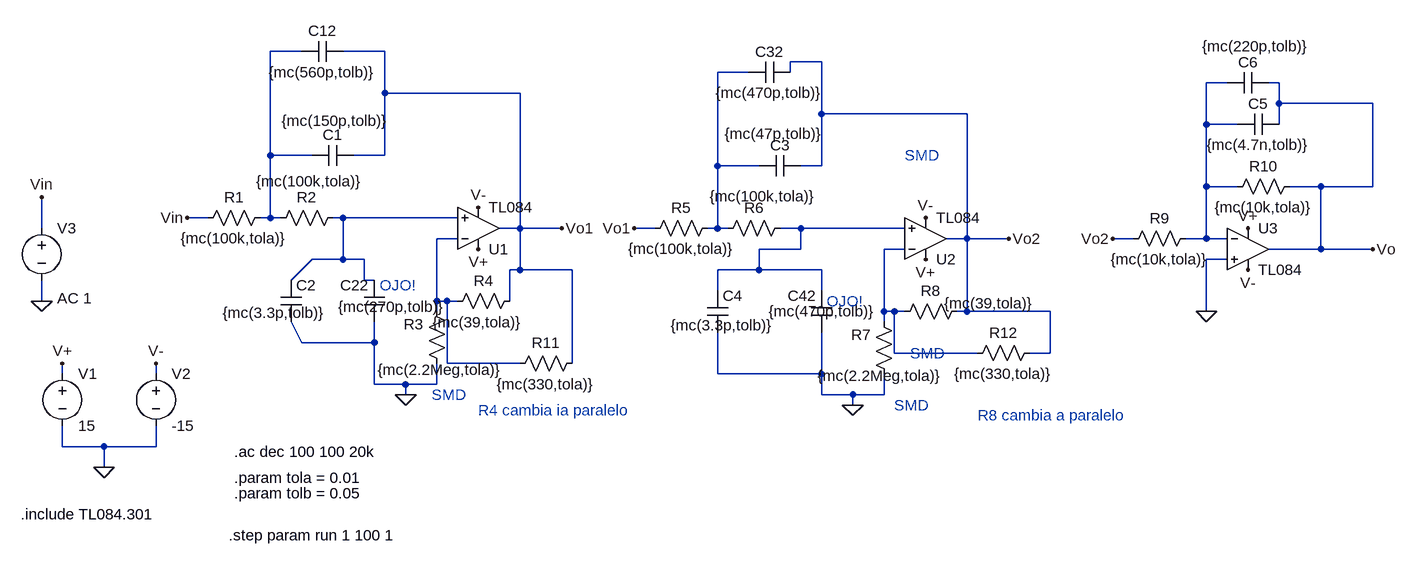
[diagram p0: schematic NUEVO Bessel CON TOLERANCIAS.asc]
NUEVO Bessel CON TOLERANCIAS.asc, the LTspice schematic file:
Version 4
SHEET 1 1604 680
WIRE -160 -96 -208 -96
WIRE -32 -96 -96 -96
WIRE 640 -80 592 -80
WIRE 528 -64 480 -64
WIRE 592 -64 592 -80
WIRE 1264 -48 1232 -48
WIRE 1344 -48 1328 -48
WIRE -32 -32 -32 -96
WIRE 176 -32 -32 -32
WIRE 1344 -16 1344 -48
WIRE 1488 -16 1344 -16
WIRE 640 0 640 -80
WIRE 864 0 640 0
WIRE 1232 16 1232 -48
WIRE 1280 16 1232 16
WIRE 1344 16 1344 -16
WIRE -208 64 -208 -96
WIRE -144 64 -208 64
WIRE -32 64 -32 -32
WIRE -32 64 -80 64
WIRE 480 80 480 -64
WIRE 544 80 480 80
WIRE 640 80 640 0
WIRE 640 80 608 80
WIRE 1232 112 1232 16
WIRE 1280 112 1232 112
WIRE 1408 112 1360 112
WIRE 1488 112 1488 -16
WIRE 1488 112 1408 112
WIRE -304 160 -336 160
WIRE -208 160 -208 64
WIRE -208 160 -224 160
WIRE -192 160 -208 160
WIRE -96 160 -112 160
WIRE 80 160 -96 160
WIRE -560 176 -560 128
WIRE 176 176 176 -32
WIRE 176 176 144 176
WIRE 240 176 176 176
WIRE 384 176 352 176
WIRE 480 176 480 80
WIRE 480 176 464 176
WIRE 496 176 480 176
WIRE 608 176 576 176
WIRE 768 176 608 176
WIRE 80 192 48 192
WIRE 864 192 864 0
WIRE 864 192 832 192
WIRE 928 192 864 192
WIRE 1120 192 1088 192
WIRE 1232 192 1232 112
WIRE 1232 192 1200 192
WIRE 1264 192 1232 192
WIRE 608 208 608 176
WIRE 608 208 544 208
WIRE 768 208 736 208
WIRE 1408 208 1408 112
WIRE 1408 208 1328 208
WIRE 1488 208 1408 208
WIRE -96 224 -96 160
WIRE -96 224 -144 224
WIRE -64 224 -96 224
WIRE 1264 224 1232 224
WIRE 176 240 176 176
WIRE 176 240 160 240
WIRE 256 240 176 240
WIRE 544 240 544 208
WIRE 544 240 480 240
WIRE 640 240 544 240
WIRE -176 256 -144 224
WIRE -64 256 -64 224
WIRE -48 256 -64 256
WIRE 480 272 480 240
WIRE 640 272 640 240
WIRE -560 288 -560 256
WIRE 48 288 48 192
WIRE 64 288 48 288
WIRE 80 288 64 288
WIRE 160 288 160 240
WIRE 48 304 48 288
WIRE 736 304 736 208
WIRE 752 304 736 304
WIRE 768 304 752 304
WIRE 864 304 864 192
WIRE 864 304 848 304
WIRE 992 304 864 304
WIRE 1232 304 1232 224
WIRE 736 320 736 304
WIRE -160 352 -176 320
WIRE -48 352 -48 320
WIRE -48 352 -160 352
WIRE 752 368 752 304
WIRE 880 368 752 368
WIRE 992 368 992 304
WIRE 992 368 960 368
WIRE 64 384 64 288
WIRE 176 384 64 384
WIRE 256 384 256 240
WIRE -528 400 -528 384
WIRE -384 400 -384 384
WIRE 480 400 480 336
WIRE 640 400 640 336
WIRE 640 400 480 400
WIRE -48 416 -48 352
WIRE 0 416 -48 416
WIRE 48 416 48 384
WIRE 48 416 0 416
WIRE 0 432 0 416
WIRE 640 432 640 400
WIRE 688 432 640 432
WIRE 736 432 736 400
WIRE 736 432 688 432
WIRE 688 448 688 432
WIRE -528 512 -528 480
WIRE -464 512 -528 512
WIRE -384 512 -384 480
WIRE -384 512 -464 512
WIRE -464 544 -464 512
FLAG 0 432 0
FLAG 112 208 V+
FLAG 1296 176 V+
FLAG 112 144 V-
FLAG 1296 240 V-
FLAG -336 160 Vin
FLAG 240 176 Vo1
FLAG 688 448 0
FLAG 800 224 V+
FLAG 800 160 V-
FLAG 352 176 Vo1
FLAG 928 192 Vo2
FLAG 1088 192 Vo2
FLAG 1232 304 0
FLAG 1488 208 Vo
FLAG -464 544 0
FLAG -528 384 V+
FLAG -384 384 V-
FLAG -560 288 0
FLAG -560 128 Vin
SYMBOL Opamps\\opamp2 112 240 M180
SYMATTR InstName U1
SYMATTR Value TL084
SYMBOL res -208 144 R90
WINDOW 0 0 56 VBottom 2
WINDOW 3 32 56 VTop 2
SYMATTR InstName R1
SYMATTR Value {mc(100k,tola)}
SYMBOL res -96 144 R90
WINDOW 0 0 56 VBottom 2
WINDOW 3 -56 52 VTop 2
SYMATTR InstName R2
SYMATTR Value {mc(100k,tola)}
SYMBOL res 64 400 R180
WINDOW 0 36 76 Left 2
WINDOW 3 -85 6 Left 2
SYMATTR InstName R3
SYMATTR Value {mc(2.2Meg,tola)}
SYMBOL cap -80 48 R90
WINDOW 0 0 32 VBottom 2
WINDOW 3 -53 28 VTop 2
SYMATTR InstName C1
SYMATTR Value {mc(150p,tolb)}
SYMBOL cap -32 320 R180
WINDOW 0 24 56 Left 2
WINDOW 3 -93 23 Left 2
SYMATTR InstName C22
SYMATTR Value {mc(270p,tolb)}
SYMBOL Opamps\\opamp2 800 256 M180
SYMATTR InstName U2
SYMATTR Value TL084
SYMBOL res 480 160 R90
WINDOW 0 0 56 VBottom 2
WINDOW 3 32 56 VTop 2
SYMATTR InstName R5
SYMATTR Value {mc(100k,tola)}
SYMBOL res 592 160 R90
WINDOW 0 0 56 VBottom 2
WINDOW 3 -49 42 VTop 2
SYMATTR InstName R6
SYMATTR Value {mc(100k,tola)}
SYMBOL res 752 416 R180
WINDOW 0 36 76 Left 2
WINDOW 3 -74 13 Left 2
SYMATTR InstName R7
SYMATTR Value {mc(2.2Meg,tola)}
SYMBOL res 752 320 R270
WINDOW 0 32 56 VTop 2
WINDOW 3 44 146 VBottom 2
SYMATTR InstName R8
SYMATTR Value {mc(39,tola)}
SYMBOL cap 656 336 R180
WINDOW 0 24 56 Left 2
WINDOW 3 -68 32 Left 2
SYMATTR InstName C42
SYMATTR Value {mc(470p,tolb)}
SYMBOL res 1216 176 R90
WINDOW 0 0 56 VBottom 2
WINDOW 3 32 56 VTop 2
SYMATTR InstName R9
SYMATTR Value {mc(10k,tola)}
SYMBOL Opamps\\opamp2 1296 144 R0
SYMATTR InstName U3
SYMATTR Value TL084
SYMBOL cap 1344 0 R90
WINDOW 0 0 32 VBottom 2
WINDOW 3 32 32 VTop 2
SYMATTR InstName C5
SYMATTR Value {mc(4.7n,tolb)}
SYMBOL res 1376 96 R90
WINDOW 0 0 56 VBottom 2
WINDOW 3 32 56 VTop 2
SYMATTR InstName R10
SYMATTR Value {mc(10k,tola)}
SYMBOL voltage -528 384 R0
WINDOW 123 0 0 Left 0
WINDOW 39 0 0 Left 0
SYMATTR InstName V1
SYMATTR Value 15
SYMBOL voltage -384 384 R0
WINDOW 123 0 0 Left 0
WINDOW 39 0 0 Left 0
SYMATTR InstName V2
SYMATTR Value -15
SYMBOL voltage -560 160 R0
WINDOW 123 24 124 Left 2
WINDOW 39 0 0 Left 0
SYMATTR Value2 AC 1
SYMATTR InstName V3
SYMATTR Value ""
SYMBOL cap -192 256 R0
WINDOW 3 -89 50 Left 2
SYMATTR InstName C2
SYMATTR Value {mc(3.3p,tolb)}
SYMBOL cap -96 -112 R90
WINDOW 0 0 32 VBottom 2
WINDOW 3 32 32 VTop 2
SYMATTR InstName C12
SYMATTR Value {mc(560p,tolb)}
SYMBOL cap 608 64 R90
WINDOW 0 0 32 VBottom 2
WINDOW 3 -49 41 VTop 2
SYMATTR InstName C3
SYMATTR Value {mc(47p,tolb)}
SYMBOL cap 592 -80 R90
WINDOW 0 0 32 VBottom 2
WINDOW 3 32 32 VTop 2
SYMATTR InstName C32
SYMATTR Value {mc(470p,tolb)}
SYMBOL cap 464 272 R0
WINDOW 3 -56 53 Left 2
SYMATTR Value {mc(3.3p,tolb)}
SYMATTR InstName C4
SYMBOL cap 1328 -64 R90
WINDOW 0 0 32 VBottom 2
WINDOW 3 -56 20 VTop 2
SYMATTR InstName C6
SYMATTR Value {mc(220p,tolb)}
SYMBOL res 176 272 R90
WINDOW 0 0 56 VBottom 2
WINDOW 3 33 65 VTop 2
SYMATTR InstName R4
SYMATTR Value {mc(39,tola)}
SYMBOL res 272 368 R90
WINDOW 0 0 56 VBottom 2
WINDOW 3 32 56 VTop 2
SYMATTR InstName R11
SYMATTR Value {mc(330,tola)}
SYMBOL res 976 352 R90
WINDOW 0 0 56 VBottom 2
WINDOW 3 32 56 VTop 2
SYMATTR InstName R12
SYMATTR Value {mc(330,tola)}
TEXT -592 616 Left 2 !.include TL084.301
TEXT 776 368 Left 2 ;SMD
TEXT -264 584 Left 2 !.param tolb = 0.05
TEXT -264 560 Left 2 !.param tola = 0.01
TEXT 648 288 Left 2 ;OJO!
TEXT 768 64 Left 2 ;SMD
TEXT -40 264 Left 2 ;OJO!
TEXT -264 520 Left 2 !.ac dec 100 100 20k
TEXT -272 648 Left 2 !.step param run 1 100 1
TEXT 40 432 Left 2 ;SMD
TEXT 752 448 Left 2 ;SMD
TEXT 880 464 Left 2 ;R8 cambia a paralelo
TEXT 112 456 Left 2 ;R4 cambia ia paralelo

The netlist it stands for:
* NUEVO Bessel CON TOLERANCIAS.asc
XU1 N004 N006 V+ V- Vo1 TL084  ; pins In+ In- V+ V- OUT
R1 N001 Vin {mc(100k,tola)}
R2 N004 N001 {mc(100k,tola)}
R3 0 N006 {mc(2.2Meg,tola)}
C1 Vo1 N001 {mc(150p,tolb)}
C22 0 N004 {mc(270p,tolb)}
XU2 N005 N007 V+ V- Vo2 TL084  ; pins In+ In- V+ V- OUT
R5 N002 Vo1 {mc(100k,tola)}
R6 N005 N002 {mc(100k,tola)}
R7 0 N007 {mc(2.2Meg,tola)}
R8 N007 Vo2 {mc(39,tola)}
C42 0 N005 {mc(470p,tolb)}
R9 N003 Vo2 {mc(10k,tola)}
XU3 0 N003 V+ V- Vo TL084  ; pins In+ In- V+ V- OUT
C5 Vo N003 {mc(4.7n,tolb)}
R10 Vo N003 {mc(10k,tola)}
V1 V+ 0 15
V2 V- 0 -15
V3 Vin 0 AC 1
C2 N004 0 {mc(3.3p,tolb)}
C12 Vo1 N001 {mc(560p,tolb)}
C3 Vo2 N002 {mc(47p,tolb)}
C32 Vo2 N002 {mc(470p,tolb)}
C4 N005 0 {mc(3.3p,tolb)}
C6 Vo N003 {mc(220p,tolb)}
R4 Vo1 N006 {mc(39,tola)}
R11 Vo1 N006 {mc(330,tola)}
R12 Vo2 N007 {mc(330,tola)}
.include TL084.301
* SMD
.param tolb = 0.05
.param tola = 0.01
* OJO!
* SMD
* OJO!
.ac dec 100 100 20k
.step param run 1 100 1
* SMD
* SMD
* R8 cambia a paralelo
* R4 cambia ia paralelo
.backanno
.end